# Altium schematic sheet Supply.SchDoc
size A4
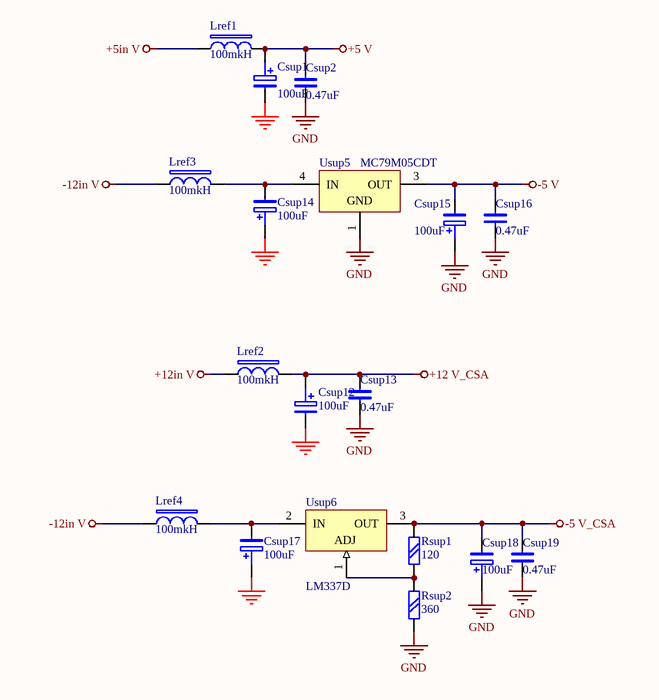
[diagram p0: Supply.SchDoc]

## Parts
Csup1  100uF  [CEL-SMD300]
Csup2  0.47uF  [chip0805]
Csup12  100uF  [CEL-SMD300]
Csup13  0.47uF  [chip0805]
Csup14  100uF  [CEL-SMD300]
Csup15  100uF  [CEL-SMD300]
Csup16  0.47uF  [chip0805]
Csup17  100uF  [CEL-SMD300]
Csup18  100uF  [CEL-SMD300]
Csup19  0.47uF  [chip0805]
Lref1  100mkH  [SDR0604]
Lref2  100mkH  [SDR0604]
Lref3  100mkH  [SDR0604]
Lref4  100mkH  [SDR0604]
Rsup1  120  [chip0805]
Rsup2  360  [chip0805]
Usup5  MC79M05CDT  [369A-13]
Usup6  LM337D  [TO-220B]

## Nets
+5 V: Csup1.+ Csup2.1 Lref1.2
+5in V: Lref1.1
+12 V_CSA: Csup12.+ Csup13.1 Lref2.2
+12in V: Lref2.1
-5 V: Csup15.- Csup16.1 Usup5.3(OUT)
-5 V_CSA: Csup18.- Csup19.1 Rsup1.1 Usup6.3(OUT)
-12in V: Lref3.1 Lref4.1
GND: Csup1.- Csup2.2 Csup12.- Csup13.2 Csup14.+ Csup15.+ Csup16.2 Csup17.+ Csup18.+ Csup19.2 Rsup2.2 Usup5.1(GND)
NetCsup14_-: Csup14.- Lref3.2 Usup5.4(IN)
NetCsup17_-: Csup17.- Lref4.2 Usup6.2(IN)
NetRsup1_2: Rsup1.2 Rsup2.1 Usup6.1(ADJ)

## Library data of the parts
Csup1 Csup12 Csup14 Csup15 Csup17 Csup18 = C POL: Text Field1: 20; Text Field2: 20
Csup2 Csup13 Csup16 Csup19 = C: Text Field1: 20; Text Field2: 10
Lref1-Lref4 = DR: Text Field1: 30; Text Field2: 10
Rsup1 Rsup2 = R: Text Field1: 20; Text Field2: 20
Usup5 = MC79M05CDT: Three-Terminal Negative Voltage Regulator; Note: Pin 4 is TAB; Pin 2 is trimmed; Published: 15-Apr-2002; DatasheetVersion: 1996; PackageVersion: 1997; PackageReference: 369A-13; Publisher: Altium Limited; PackageDescription: D-PAK/TO-252-AA; 3 Leads (1 Cropped); Body 10.3 (inc. leads) x 6.7 mm (LxW max); ComponentLink1Description: Manufacturer Link; ComponentLink1URL: http://www.onsemi.com/site/products/taxonomy/0,4438,503,00.html; ComponentLink2Description: Datasheet; ComponentLink2URL: http://www.onsemi.com/pub/Collateral/MC79M00-D.PDF
Usup6 = LM337T: Three-Terminal Adjustable Output Negative Voltage; Note: Heatsink surface is connected to Pin 2; Published: 15-Apr-2002; DatasheetVersion: 1996; PackageVersion: 1997; PackageReference: 221A-06; Publisher: Altium Limited; PackageDescription: TO, Thru-Hole, Vertical, Heatsink Mounted; 3 In-Line Leads; Pitch 2.54 mm; Code_JEDEC: TO-262-AA; ComponentLink1Description: Manufacturer Link; ComponentLink1URL: http://www.onsemi.com/site/products/taxonomy/0,4438,503,00.html; ComponentLink2Description: Datasheet; ComponentLink2URL: http://www.onsemi.com/pub/Collateral/LM337-D.PDF